# Altium schematic sheet 09 EPDC EXP PORTS.SchDoc
size 513 x 386 mm
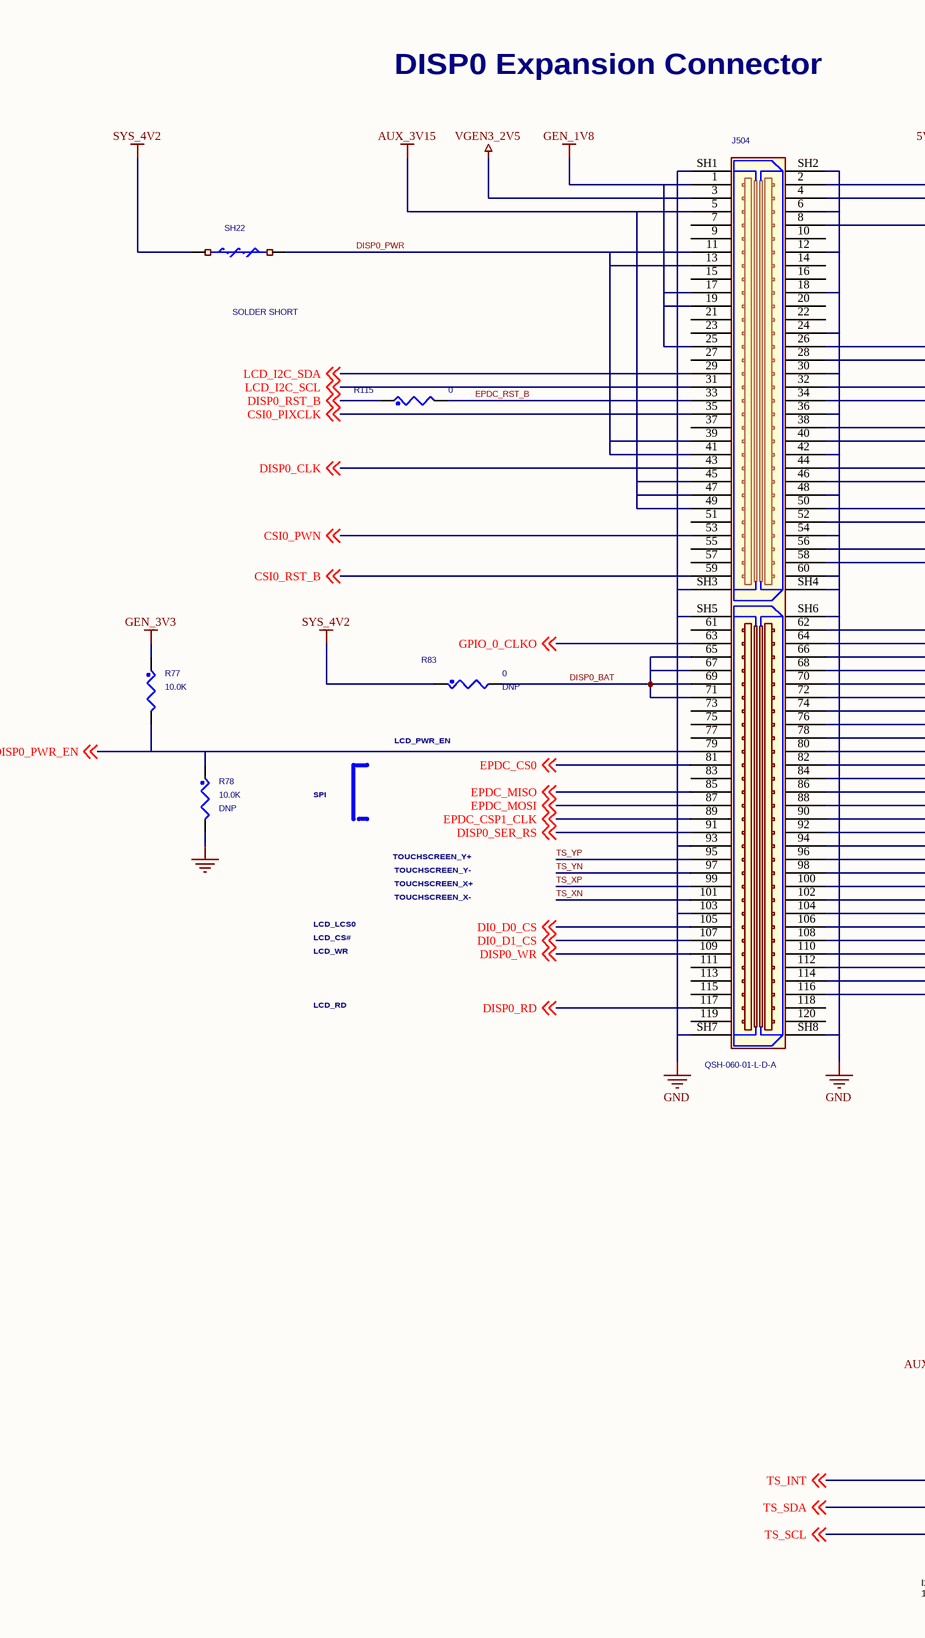
[diagram p0: 09 EPDC EXP PORTS.SchDoc, left]
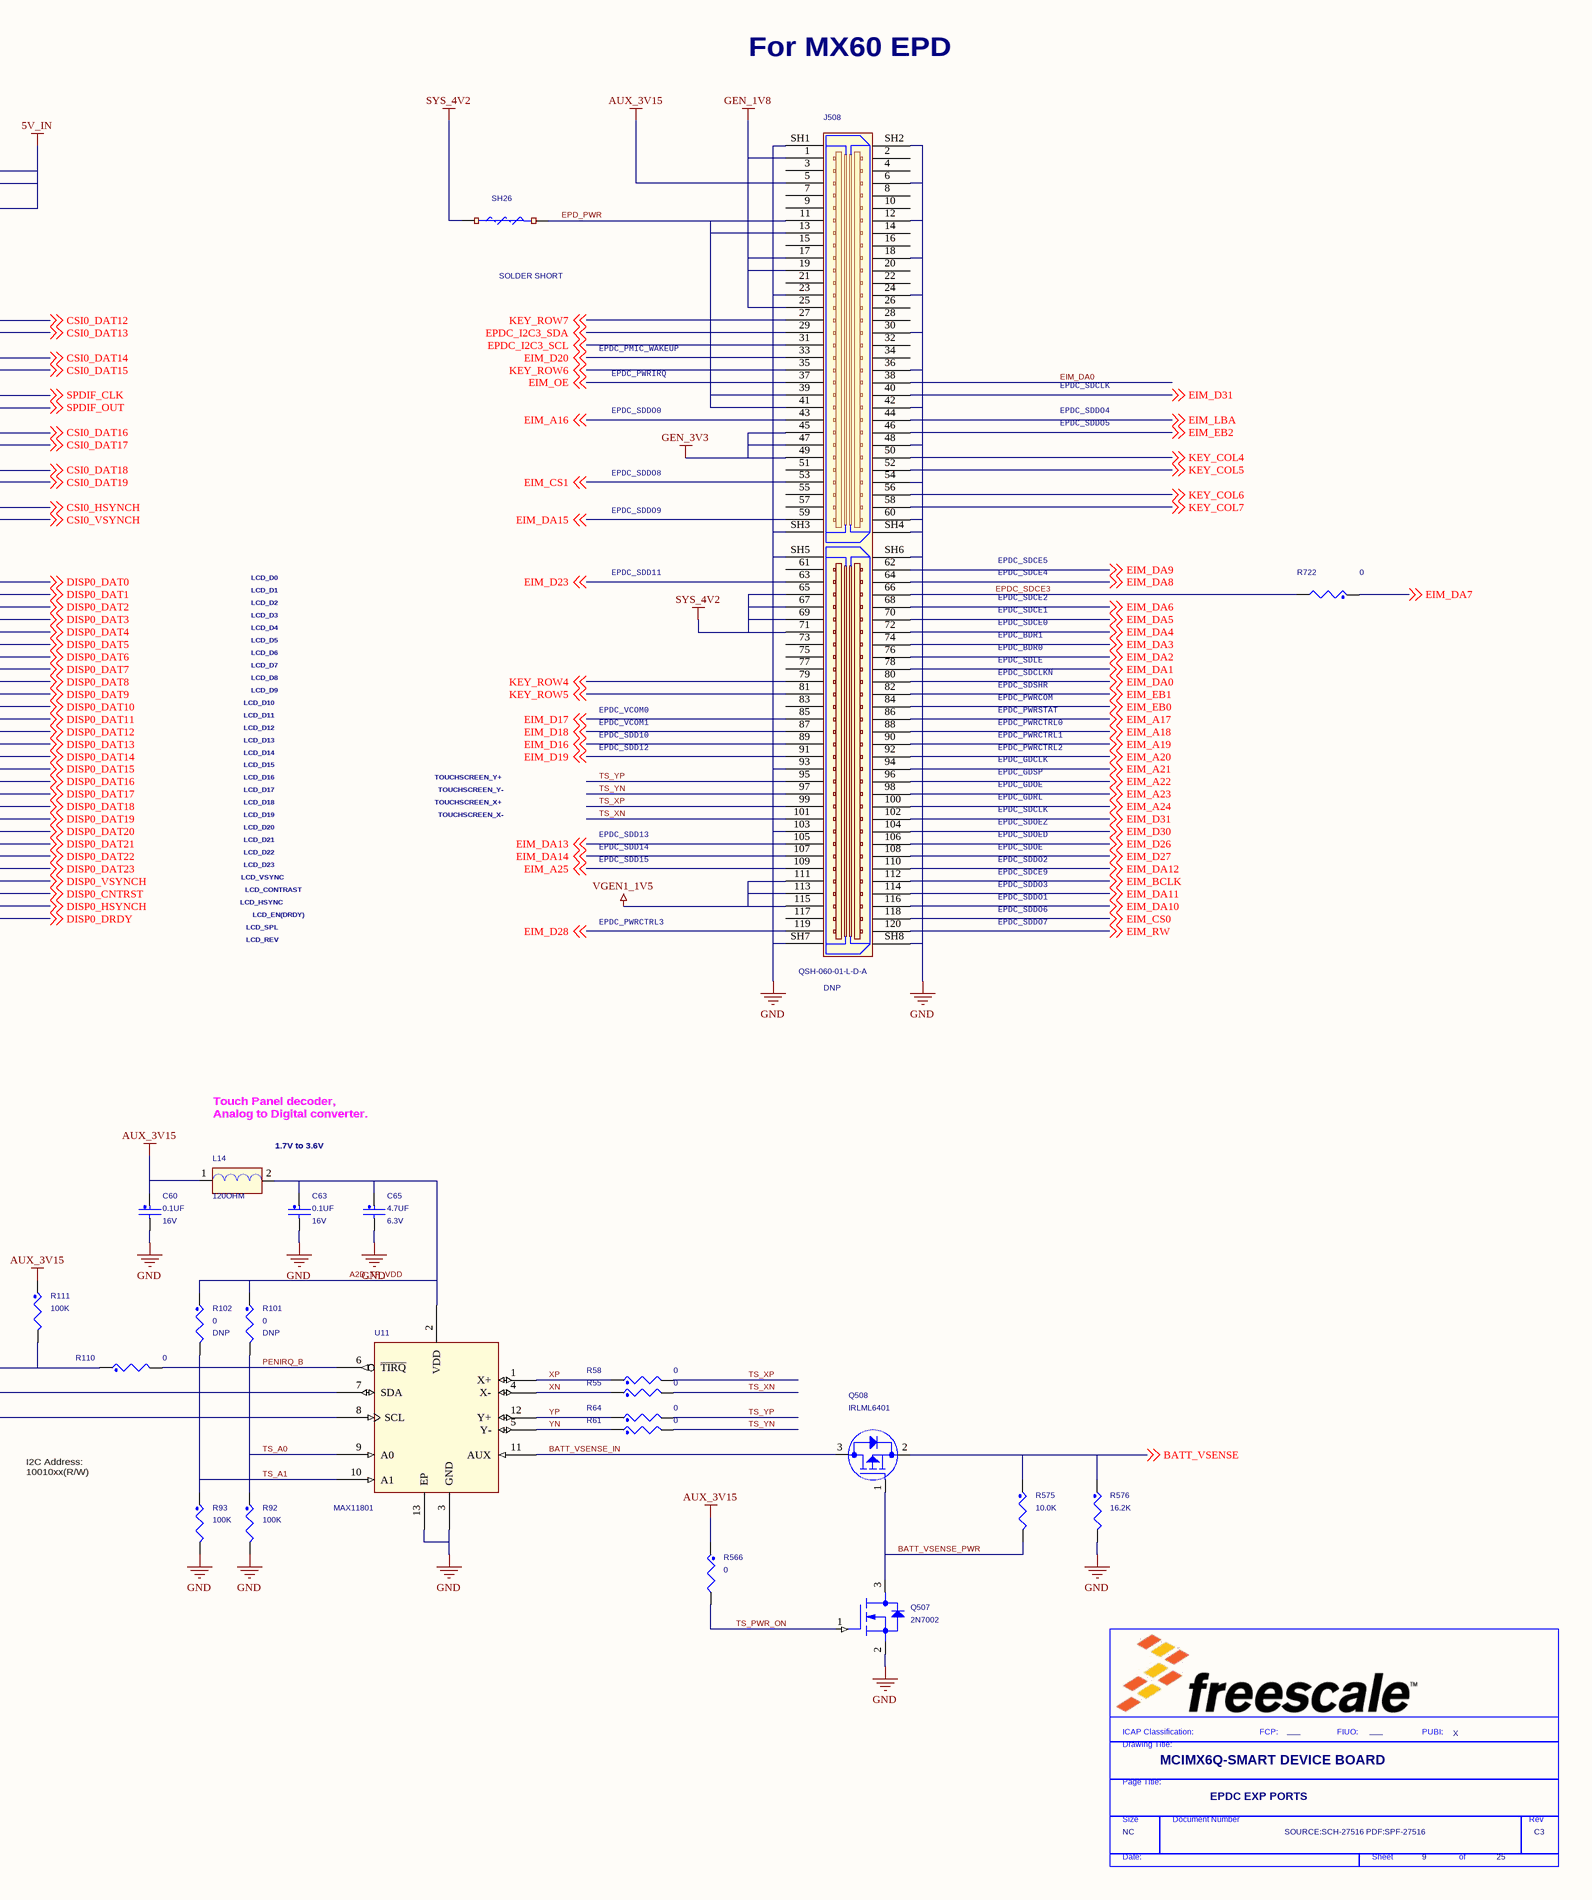
[diagram p1: 09 EPDC EXP PORTS.SchDoc, right]

## Parts
*  FIUO: ___  PUBI: X  Doc: SOURCE:SCH-27516 PDF:SPF-27516  RevCode: C3  Title: MCIMX6Q-SMART DEVICE BOARD  Page Size: NC  Page Number: 9  Page Count: 25  PageTitle: EPDC EXP PORTS  (hidden comment: TitleBlock_FS)  (graphical)
C60  0.1UF  WVDC: 16V  [0402_CC]
C63  0.1UF  WVDC: 16V  [0402_CC]
C65  4.7UF  WVDC: 6.3V  [0603_CC]
J504  QSH-060-01-L-D-A  [CON_120S_QSH_SM_05PITCH]
J508  QSH-060-01-L-D-A  ASSY_OPT: DNP  [CON_120S_QSH_SM_05PITCH]
L14  120OHM  [0603_CC]
Q507  2N7002  [SOT23]
Q508  IRLML6401  [sot-23]
R55  0  [0402_CC]
R58  0  [0402_CC]
R61  0  [0402_CC]
R64  0  [0402_CC]
R77  10.0K  [0402_CC]
R78  10.0K  ASSY_OPT: DNP  [0402_CC]
R83  0  ASSY_OPT: DNP  [0402_CC]
R92  100K  [0402_CC]
R93  100K  [0402_CC]
R101  0  ASSY_OPT: DNP  [0402_CC]
R102  0  ASSY_OPT: DNP  [0402_CC]
R110  0  [0402_CC]
R111  100K  [0402_CC]
R115  0  [0402_CC]
R566  0  [0402_CC]
R575  10.0K  [0402_CC]
R576  16.2K  [0402_CC]
R722  0  [0402_CC]
SH22  SOLDER SHORT  [SH0805_40]
SH26  SOLDER SHORT  [SH0805_40]
U11  MAX11801  [QFN12]

## Nets
5V_IN: J504.2 J504.4 J504.8
AUX_3V15: C60.1 J504.5 J504.45 J504.47 J504.49 J508.5 L14.1 R111.1 R566.1
GEN_1V8: J504.1 J504.17 J504.19 J504.25 J508.1 J508.17 J508.19 J508.25
GEN_3V3: J508.45 J508.47 J508.49 R77.1
GND: C60.2 C63.2 C65.2 J504.6 J504.12 J504.18 J504.24 J504.30 J504.36 J504.42 J504.48 J504.54 J504.60 J504.93 J504.103 J504.SH1 J504.SH2 J504.SH3 J504.SH4 J504.SH5 J504.SH6 J504.SH7 J504.SH8 J508.6 J508.12 J508.18 J508.23 J508.24 J508.30 J508.36 J508.42 J508.48 J508.54 J508.60 J508.93 J508.103 J508.SH1 J508.SH2 J508.SH3 J508.SH4 J508.SH5 J508.SH6 J508.SH7 J508.SH8 Q507.2(SOURCE) R78.2 R92.2 R93.2 R576.2 U11.3(GND) U11.13(EP)
SYS_4V2: J508.65 J508.67 J508.69 J508.71 R83.1 SH22.1 SH26.1
VGEN1_1V5: J508.111 J508.113 J508.115
VGEN3_2V5: J504.3
A2D_TP_VDD: C63.1 C65.1 L14.2 R101.1 R102.1 U11.2(VDD)
BATT_VSENSE: Q508.2(SOURCE) R575.1 R576.1 ; off-sheet BATT_VSENSE
BATT_VSENSE_IN: Q508.3(DRAIN) U11.11(AUX)
BATT_VSENSE_PWR: Q507.3(DRAIN) Q508.1(GATE) R575.2
CSI0_DAT12: J504.26 ; off-sheet CSI0_DAT12
CSI0_DAT13: J504.28 ; off-sheet CSI0_DAT13
CSI0_DAT14: J504.32 ; off-sheet CSI0_DAT14
CSI0_DAT15: J504.34 ; off-sheet CSI0_DAT15
CSI0_DAT16: J504.44 ; off-sheet CSI0_DAT16
CSI0_DAT17: J504.46 ; off-sheet CSI0_DAT17
CSI0_DAT18: J504.50 ; off-sheet CSI0_DAT18
CSI0_DAT19: J504.52 ; off-sheet CSI0_DAT19
CSI0_HSYNCH: J504.56 ; off-sheet CSI0_HSYNCH
CSI0_PIXCLK: J504.35 ; off-sheet CSI0_PIXCLK
CSI0_PWN: J504.53 ; off-sheet CSI0_PWN
CSI0_RST_B: J504.59 ; off-sheet CSI0_RST_B
CSI0_VSYNCH: J504.58 ; off-sheet CSI0_VSYNCH
DI0_D0_CS: J504.105 ; off-sheet DI0_D0_CS
DI0_D1_CS: J504.107 ; off-sheet DI0_D1_CS
DISP0_BAT: J504.65 J504.67 J504.69 J504.71 R83.2
DISP0_CLK: J504.43 ; off-sheet DISP0_CLK
DISP0_CNTRST: J504.112 ; off-sheet DISP0_CNTRST
DISP0_DAT0: J504.62 ; off-sheet DISP0_DAT0
DISP0_DAT1: J504.64 ; off-sheet DISP0_DAT1
DISP0_DAT2: J504.66 ; off-sheet DISP0_DAT2
DISP0_DAT3: J504.68 ; off-sheet DISP0_DAT3
DISP0_DAT4: J504.70 ; off-sheet DISP0_DAT4
DISP0_DAT5: J504.72 ; off-sheet DISP0_DAT5
DISP0_DAT6: J504.74 ; off-sheet DISP0_DAT6
DISP0_DAT7: J504.76 ; off-sheet DISP0_DAT7
DISP0_DAT8: J504.78 ; off-sheet DISP0_DAT8
DISP0_DAT9: J504.80 ; off-sheet DISP0_DAT9
DISP0_DAT10: J504.82 ; off-sheet DISP0_DAT10
DISP0_DAT11: J504.84 ; off-sheet DISP0_DAT11
DISP0_DAT12: J504.86 ; off-sheet DISP0_DAT12
DISP0_DAT13: J504.88 ; off-sheet DISP0_DAT13
DISP0_DAT14: J504.90 ; off-sheet DISP0_DAT14
DISP0_DAT15: J504.92 ; off-sheet DISP0_DAT15
DISP0_DAT16: J504.94 ; off-sheet DISP0_DAT16
DISP0_DAT17: J504.96 ; off-sheet DISP0_DAT17
DISP0_DAT18: J504.98 ; off-sheet DISP0_DAT18
DISP0_DAT19: J504.100 ; off-sheet DISP0_DAT19
DISP0_DAT20: J504.102 ; off-sheet DISP0_DAT20
DISP0_DAT21: J504.104 ; off-sheet DISP0_DAT21
DISP0_DAT22: J504.106 ; off-sheet DISP0_DAT22
DISP0_DAT23: J504.108 ; off-sheet DISP0_DAT23
DISP0_DRDY: J504.116 ; off-sheet DISP0_DRDY
DISP0_HSYNCH: J504.114 ; off-sheet DISP0_HSYNCH
DISP0_PWR: J504.11 J504.13 J504.39 J504.41 SH22.2
DISP0_PWR_EN: J504.79 R77.2 R78.1 ; off-sheet DISP0_PWR_EN
DISP0_RD: J504.117 ; off-sheet DISP0_RD
DISP0_RST_B: R115.1 ; off-sheet DISP0_RST_B
DISP0_SER_RS: J504.91 ; off-sheet DISP0_SER_RS
DISP0_VSYNCH: J504.110 ; off-sheet DISP0_VSYNCH
DISP0_WR: J504.109 ; off-sheet DISP0_WR
EIM_A16: J508.43 ; off-sheet EIM_A16
EIM_A17: J508.86 ; off-sheet EIM_A17
EIM_A18: J508.88 ; off-sheet EIM_A18
EIM_A19: J508.90 ; off-sheet EIM_A19
EIM_A20: J508.92 ; off-sheet EIM_A20
EIM_A21: J508.94 ; off-sheet EIM_A21
EIM_A22: J508.96 ; off-sheet EIM_A22
EIM_A23: J508.98 ; off-sheet EIM_A23
EIM_A24: J508.100 ; off-sheet EIM_A24
EIM_A25: J508.109 ; off-sheet EIM_A25
EIM_BCLK: J508.112 ; off-sheet EIM_BCLK
EIM_CS0: J508.118 ; off-sheet EIM_CS0
EIM_CS1: J508.53 ; off-sheet EIM_CS1
EIM_D16: J508.89 ; off-sheet EIM_D16
EIM_D17: J508.85 ; off-sheet EIM_D17
EIM_D18: J508.87 ; off-sheet EIM_D18
EIM_D19: J508.91 ; off-sheet EIM_D19
EIM_D20: J508.33 ; off-sheet EIM_D20
EIM_D23: J508.63 ; off-sheet EIM_D23
EIM_D26: J508.106 ; off-sheet EIM_D26
EIM_D27: J508.108 ; off-sheet EIM_D27
EIM_D28: J508.119 ; off-sheet EIM_D28
EIM_D30: J508.104 ; off-sheet EIM_D30
EIM_D31: J508.40 J508.102 ; off-sheet EIM_D31
EIM_DA0: J508.38 J508.80 ; off-sheet EIM_DA0
EIM_DA1: J508.78 ; off-sheet EIM_DA1
EIM_DA2: J508.76 ; off-sheet EIM_DA2
EIM_DA3: J508.74 ; off-sheet EIM_DA3
EIM_DA4: J508.72 ; off-sheet EIM_DA4
EIM_DA5: J508.70 ; off-sheet EIM_DA5
EIM_DA6: J508.68 ; off-sheet EIM_DA6
EIM_DA7: R722.1 ; off-sheet EIM_DA7
EIM_DA8: J508.64 ; off-sheet EIM_DA8
EIM_DA9: J508.62 ; off-sheet EIM_DA9
EIM_DA10: J508.116 ; off-sheet EIM_DA10
EIM_DA11: J508.114 ; off-sheet EIM_DA11
EIM_DA12: J508.110 ; off-sheet EIM_DA12
EIM_DA13: J508.105 ; off-sheet EIM_DA13
EIM_DA14: J508.107 ; off-sheet EIM_DA14
EIM_DA15: J508.59 ; off-sheet EIM_DA15
EIM_EB0: J508.84 ; off-sheet EIM_EB0
EIM_EB1: J508.82 ; off-sheet EIM_EB1
EIM_EB2: J508.46 ; off-sheet EIM_EB2
EIM_LBA: J508.44 ; off-sheet EIM_LBA
EIM_OE: J508.37 ; off-sheet EIM_OE
EIM_RW: J508.120 ; off-sheet EIM_RW
EPD_PWR: J508.11 J508.13 J508.39 J508.41 SH26.2
EPDC_CS0: J504.81 ; off-sheet EPDC_CS0
EPDC_CSP1_CLK: J504.89 ; off-sheet EPDC_CSP1_CLK
EPDC_I2C3_SCL: J508.31 ; off-sheet EPDC_I2C3_SCL
EPDC_I2C3_SDA: J508.29 ; off-sheet EPDC_I2C3_SDA
EPDC_MISO: J504.85 ; off-sheet EPDC_MISO
EPDC_MOSI: J504.87 ; off-sheet EPDC_MOSI
EPDC_RST_B: J504.33 R115.2
EPDC_SDCE3: J508.66 R722.2
GPIO_0_CLKO: J504.63 ; off-sheet GPIO_0_CLKO
KEY_COL4: J508.50 ; off-sheet KEY_COL4
KEY_COL5: J508.52 ; off-sheet KEY_COL5
KEY_COL6: J508.56 ; off-sheet KEY_COL6
KEY_COL7: J508.58 ; off-sheet KEY_COL7
KEY_ROW4: J508.79 ; off-sheet KEY_ROW4
KEY_ROW5: J508.81 ; off-sheet KEY_ROW5
KEY_ROW6: J508.35 ; off-sheet KEY_ROW6
KEY_ROW7: J508.27 ; off-sheet KEY_ROW7
LCD_I2C_SCL: J504.31 ; off-sheet LCD_I2C_SCL
LCD_I2C_SDA: J504.29 ; off-sheet LCD_I2C_SDA
PENIRQ_B: R110.2 U11.6(~{TIRQ})
SPDIF_CLK: J504.38 ; off-sheet SPDIF_CLK
SPDIF_OUT: J504.40 ; off-sheet SPDIF_OUT
TS_A0: R92.1 R101.2 U11.9(A0)
TS_A1: R93.1 R102.2 U11.10(A1)
TS_INT: R110.1 R111.2 ; off-sheet TS_INT
TS_PWR_ON: Q507.1(GATE) R566.2
TS_SCL: U11.8(SCL) ; off-sheet TS_SCL
TS_SDA: U11.7(SDA) ; off-sheet TS_SDA
TS_XN: J504.101 J508.101 R55.2
TS_XP: J504.99 J508.99 R58.2
TS_YN: J504.97 J508.97 R61.2
TS_YP: J504.95 J508.95 R64.2
XN: R55.1 U11.4(X-)
XP: R58.1 U11.1(X+)
YN: R61.1 U11.5(Y-)
YP: R64.1 U11.12(Y+)

Not connected (* = marked no-connect by the designer): J504 7 9 10 14 15 16 20 21 22 23 27 37 51 55 57 61 73 75 77 83 111 113 115 118 119 120; J508 2 3 4 7 8 9 10 14 15 16 20 21 22 26 28 32 34 51 55 57 61 73 75 77 83 117

## Notes on the sheet
- DISP0 Expansion Connector
- For MX60 EPD
- EPDC_PMIC_WAKEUP
- EPDC_PWRIRQ
- EPDC_SDCLK
- EPDC_SDDO0
- EPDC_SDDO5
- EPDC_SDDO4
- EPDC_SDDO8
- EPDC_SDDO9
- LCD_D0
- LCD_D1
- EPDC_SDD11
- EPDC_SDCE4
- EPDC_SDCE5
- LCD_D2
- LCD_D3
- LCD_D4
- LCD_D5
- LCD_D6
- EPDC_BDR0
- EPDC_BDR1
- EPDC_SDCE1
- EPDC_SDCE2
- EPDC_SDCE0
- LCD_PWR_EN
- LCD_D10
- LCD_D11
- LCD_D7
- LCD_D8
- LCD_D9
- EPDC_VCOM0
- EPDC_SDLE
- EPDC_PWRSTAT
- EPDC_PWRCOM
- EPDC_SDSHR
- EPDC_SDCLKN
- SPI
- LCD_D15
- LCD_D16
- LCD_D12
- LCD_D13
- LCD_D14
- TOUCHSCREEN_Y+
- EPDC_VCOM1
- EPDC_SDD10
- EPDC_SDD12
- EPDC_PWRCTRL1
- EPDC_PWRCTRL2
- EPDC_GDCLK
- EPDC_GDSP
- EPDC_PWRCTRL0
- TOUCHSCREEN_X-
- TOUCHSCREEN_X+
- TOUCHSCREEN_Y-
- LCD_D17
- LCD_D18
- LCD_D19
- LCD_D20
- LCD_D21
- EPDC_SDD13
- EPDC_GDOE
- EPDC_GDRL
- EPDC_SDOEZ
- EPDC_SDOED
- LCD_CS#
- LCD_LCS0
- LCD_WR
- LCD_HSYNC
- LCD_VSYNC
- LCD_D22
- LCD_D23
- LCD_CONTRAST
- EPDC_SDD14
- EPDC_SDD15
- EPDC_SDDO2
- EPDC_SDOE
- EPDC_SDDO1
- EPDC_SDDO3
- EPDC_SDCE9
- LCD_RD
- LCD_SPL
- LCD_REV
- LCD_EN(DRDY)
- EPDC_PWRCTRL3
- EPDC_SDDO6
- EPDC_SDDO7
- Touch Panel decoder,
  Analog to Digital converter.
- (near L14) 1.7V to 3.6V
- I2C Address:
  10010xx(R/W)
- (in symbol TitleBlock_FS) ICAP Classification:; FCP:; FIUO:; PUBI:; Drawing Title:; Page Title:; Size; Document Number; Rev; Date:; Sheet; of

## Library data of the parts
* = TitleBlock_FS: OrgName: Freescale Semiconductor; OrgAddr1: 6501 William Cannon Drive West; OrgAddr2: Austin, TX 78735-8598; FCP: ___; Page Create Date: March  8, 1995
C60 C63 = CAP_NP: CAP CER 0.1UF 16V 10% X7R 0402; CLASS: DISCRETE; FPLIST: CC0402_25,CC0402_HD,0402_CC; CAD_APPROVED: Yes; MFG_PN01: C0402C104K4RAC; MFG_NAME01: KEMET; AGILE_PN: 150-75182; SIGNAL_MODEL: DEFAULT_CAPACITOR_100000pF_2_1; HEIGHT: 0.635MM; ROHS: Yes; Tolerance: 10%; VOLTAGE: 16V
C65 = CAP_NP: CAP CER 4.7UF 6.3V 10% X5R 0603; CLASS: DISCRETE; ROOM: DISP1; AGILE_PN: 150-75487; MFG_NAME01: VENKEL COMPANY; MFG_PN01: C0603X5R6R3-475KNP; CAD_APPROVED: Yes; PRIORITY_PN: 921-00228; FPLIST: CC0603_OV,CC0603,0603_CC; SIGNAL_MODEL: DEFAULT_CAPACITOR_4.7e+06pF_2_1; Tolerance: 10%; ROHS: Yes; HEIGHT: 1.016MM; VOLTAGE: 6.3V
J504 = QSH060: CON 2X60 SKT SMT 0.5MM SP AU; CLASS: IO; Room: Port5_ckt_pg14; CAD_APPROVED: Yes; MFG_NAME01: SAMTEC; AGILE_PN: 211-75241; PRIORITY_PN: 009-00691; HEIGHT: 3.25 MM; ROHS: Yes; MFG_PN01: QSH-060-01-L-D-A
J508 = QSH060: CON 2X60 SKT SMT 0.5MM SP AU; CLASS: IO; PRIORITY_PN: 009-00691; AGILE_PN: 211-75241; MFG_NAME01: SAMTEC; CAD_APPROVED: Yes; Room: Port5_ckt_pg14; MFG_PN01: QSH-060-01-L-D-A; ROHS: Yes; HEIGHT: 3.25 MM
L14 = BEAD: IND FER BEAD 120OHM@100MHZ 2A 25% 0603; PART_TYPE: FERRITE; CLASS: DISCRETE; PRIORITY_PN: 024-00067; FPLIST: IND_0603,0603_CC; CAD_APPROVED: Yes; MFG_PN01: BLM18PG121SH1; MFG_NAME01: MURATA; AGILE_PN: 180-30008; HEIGHT: 0.95MM; ROHS: Yes; Tolerance: 25%
Q507 = 2N7002: TRAN NMOS 60V 115MA SOT23; CLASS: IC; AGILE_PN: 480-75159; MFG_NAME01: ON SEMICONDUCTOR; MFG_PN01: 2N7002LT1G; CAD_APPROVED: Yes; ROHS: Yes; HEIGHT: 1.3MM
Q508 = MOSFET_P: TRAN PMOS PWR 12V 4.3A SOT23; CLASS: IC; AGILE_PN: 480-77718; MFG_NAME01: INTERNATIONAL RECTIFIER; MFG_PN01: IRLML6401TRPBF; CAD_APPROVED: Yes; ROHS: Yes; HEIGHT: 1.12MM
R55 R64 = RES: RES MF ZERO OHM 1/10W -- 0402; CLASS: DISCRETE; FPLIST: RC0402_25,RC0402_HD,RC0402_X2,0402_CC; PRIORITY_PN: 006-00559; CAD_APPROVED: Yes; MFG_PN01: ERJ-2GE0R00X; MFG_NAME01: Panasonic; AGILE_PN: 470-79965; SIGNAL_MODEL: DEFAULT_RESISTOR_0.001OHM_2_1; ROHS: Yes
R58 R61 = RES: RES MF ZERO OHM 1/10W -- 0402; CLASS: DISCRETE; PRIORITY_PN: 006-00559; CAD_APPROVED: Yes; MFG_PN01: ERJ-2GE0R00X; MFG_NAME01: Panasonic; AGILE_PN: 470-79965; FPLIST: RC0402_25,RC0402_HD,RC0402_X2,0402_CC; SIGNAL_MODEL: DEFAULT_RESISTOR_0.001OHM_2_1; ROHS: Yes
R77 = RES: RES MF 10.0K 1/16W 1% 0402; CLASS: DISCRETE; ROOM: DISP1; AGILE_PN: 470-75416; MFG_NAME01: VISHAY INTERTECHNOLOGY; MFG_PN01: CRCW040210K0FKED; CAD_APPROVED: Yes; PRIORITY_PN: 006-00552; FPLIST: RC0402_25,RC0402_HD,0402_CC; SIGNAL_MODEL: DEFAULT_RESISTOR_10000OHM_2_1; Tolerance: 1%; ROHS: Yes
R78 = RES: RES MF 10.0K 1/16W 1% 0402; CLASS: DISCRETE; PRIORITY_PN: 006-00552; CAD_APPROVED: Yes; MFG_PN01: CRCW040210K0FKED; MFG_NAME01: VISHAY INTERTECHNOLOGY; AGILE_PN: 470-75416; FPLIST: RC0402_25,RC0402_HD,0402_CC; SIGNAL_MODEL: DEFAULT_RESISTOR_10000OHM_2_1; ROHS: Yes; Tolerance: 1%
R83 R115 R722 = RES: RES MF ZERO OHM 1/10W -- 0402; CLASS: DISCRETE; ROOM: ATLAS-AP; AGILE_PN: 470-79965; MFG_NAME01: Panasonic; MFG_PN01: ERJ-2GE0R00X; CAD_APPROVED: Yes; FPLIST: RC0402_25,RC0402_HD,RC0402_X2,0402_CC; PRIORITY_PN: 006-00559; SIGNAL_MODEL: DEFAULT_RESISTOR_0.001OHM_2_1; ROHS: Yes
R92 R93 = RES: RES MF 100K 1/16W 1% 0402; CLASS: DISCRETE; ROOM: DISP1; AGILE_PN: 470-76240; MFG_NAME01: KOA SPEER; MFG_PN01: RK73H1ETTP1003F; CAD_APPROVED: Yes; FPLIST: RC0402_25,rc0402_frs; PRIORITY_PN: 006-00657; SIGNAL_MODEL: DEFAULT_RESISTOR_100000OHM_2_1; Tolerance: 1%; ROHS: Yes
R101 R102 = RES: RES MF ZERO OHM 1/10W -- 0402; CLASS: DISCRETE; ROOM: DISP1; PRIORITY_PN: 006-00559; FPLIST: RC0402_25,RC0402_HD,RC0402_X2,0402_CC; CAD_APPROVED: Yes; MFG_PN01: ERJ-2GE0R00X; MFG_NAME01: Panasonic; AGILE_PN: 470-79965; SIGNAL_MODEL: DEFAULT_RESISTOR_0.001OHM_2_1; ROHS: Yes
R110 = RES: RES MF ZERO OHM 1/10W -- 0402; CLASS: DISCRETE; PRIORITY_PN: 006-00559; FPLIST: RC0402_25,RC0402_HD,RC0402_X2,0402_CC; CAD_APPROVED: Yes; MFG_PN01: ERJ-2GE0R00X; MFG_NAME01: Panasonic; AGILE_PN: 470-79965; ROOM: ATLAS-AP; SIGNAL_MODEL: DEFAULT_RESISTOR_0.001OHM_2_1; ROHS: Yes
R111 = RES: RES MF 100K 1/16W 1% 0402; CLASS: DISCRETE; FPLIST: RC0402_25,RC0402_HD,0402_CC; CAD_APPROVED: Yes; MFG_PN01: RK73H1ETTP1003F; MFG_NAME01: KOA SPEER; AGILE_PN: 470-76240; SIGNAL_MODEL: DEFAULT_RESISTOR_100000OHM_2_1; ROHS: Yes; Tolerance: 1%
R566 = RES: RES MF ZERO OHM 1/10W -- 0402; CLASS: DISCRETE; FPLIST: RC0402_25,RC0402_HD,RC0402_X2,0402_CC; CAD_APPROVED: Yes; MFG_PN01: ERJ-2GE0R00X; MFG_NAME01: Panasonic; AGILE_PN: 470-79965; SIGNAL_MODEL: DEFAULT_RESISTOR_0.001OHM_2_1; ROHS: Yes
R575 = RES: RES MF 10.0K 1/16W 1% 0402; CLASS: DISCRETE; AGILE_PN: 470-75416; MFG_NAME01: VISHAY INTERTECHNOLOGY; MFG_PN01: CRCW040210K0FKED; CAD_APPROVED: Yes; FPLIST: RC0402_25,RC0402_HD,0402_CC; SIGNAL_MODEL: DEFAULT_RESISTOR_10000OHM_2_1; Tolerance: 1%; ROHS: Yes
R576 = RES: RES MF 16.2K 1/16W 1% 0402; CLASS: DISCRETE; AGILE_PN: 470-76206; MFG_NAME01: KOA SPEER; MFG_PN01: RK73H1ETTP1622F; CAD_APPROVED: Yes; FPLIST: RC0402_25,RC0402_HD,0402_CC; SIGNAL_MODEL: DEFAULT_RESISTOR_16200OHM_2_1; Tolerance: 1%; ROHS: Yes
SH22 = RES_SHORT-2: SOLDER SHORT 0805  SMT NO PART TO ORDER; CLASS: DISCRETE; AGILE_PN: 470-80202; MFG_NAME01: NOTACOMPONENT; MFG_PN01: SOLDER_SHORT_0805; ASSY_OPT: DNP; CAD_APPROVED: Yes; FPLIST: SH0805,SH0805CUST,SH0805_40; ROHS: Yes
SH26 = RES_SHORT-2: SOLDER SHORT 0805  SMT NO PART TO ORDER; CLASS: DISCRETE; FPLIST: SH0805,SH0805CUST,SH0805_40; CAD_APPROVED: Yes; ASSY_OPT: DNP; MFG_PN01: SOLDER_SHORT_0805; MFG_NAME01: NOTACOMPONENT; AGILE_PN: 470-80202; ROHS: Yes
U11 = MAX11801_TQFN_12P: IC CTLER TOUCH SCREEN  I2C 400KHZ 1.7-3.6V TQFN12; AGILE_PN: 315-79074; MFG_NAME01: MAXIM; MFG_PN01: MAX11801GTC/V+; CAD_APPROVED: Yes; PRIORITY_PN: 051-MAX11801GTC; CLASS: IC; ROHS: Yes; HEIGHT: 0.8MM